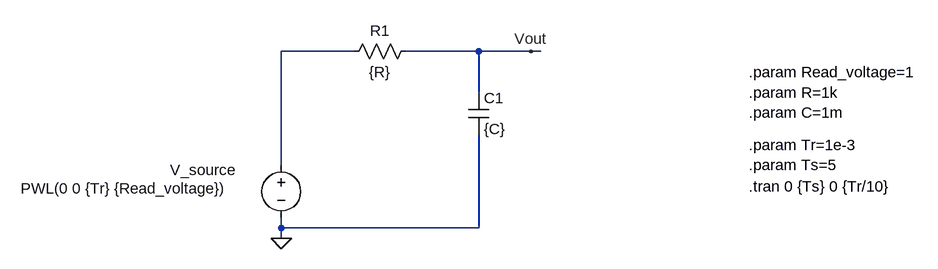
[diagram p0: schematic RC_ckt_transient.asc]
RC_ckt_transient.asc, the LTspice schematic file:
Version 4
SHEET 1 1552 680
WIRE 48 -64 -64 -64
WIRE 240 -64 128 -64
WIRE 320 -64 240 -64
WIRE 336 -64 320 -64
WIRE 240 0 240 -64
WIRE -64 112 -64 -64
WIRE -64 208 -64 192
WIRE 240 208 240 64
WIRE 240 208 -64 208
WIRE -64 224 -64 208
FLAG -64 224 0
FLAG 320 -64 Vout
SYMBOL voltage -64 96 R0
WINDOW 0 -171 23 Left 2
WINDOW 3 -401 51 Left 2
WINDOW 123 0 0 Left 0
WINDOW 39 -189 77 Left 2
SYMATTR InstName V_source
SYMATTR Value PWL(0 0 {Tr} {Read_voltage})
SYMBOL res 144 -80 R90
WINDOW 0 0 56 VBottom 2
WINDOW 3 32 56 VTop 2
SYMATTR InstName R1
SYMATTR Value {R}
SYMBOL cap 224 0 R0
SYMATTR InstName C1
SYMATTR Value {C}
TEXT 656 144 Left 2 !.tran 0 {Ts} 0 {Tr/10}
TEXT 656 80 Left 2 !.param Tr=1e-3\n.param Ts=5
TEXT 656 -32 Left 2 !.param Read_voltage=1\n.param R=1k\n.param C=1m

The netlist it stands for:
* RC_ckt_transient.asc
V_source N001 0 PWL(0 0 {Tr} {Read_voltage})
R1 Vout N001 {R}
C1 Vout 0 {C}
.tran 0 {Ts} 0 {Tr/10}
.param Tr=1e-3
.param Ts=5
.param Read_voltage=1
.param R=1k
.param C=1m
.backanno
.end